# Altium schematic sheet GNSS.SchDoc: CATS Telemetry
size A4; Author: Luca Jost; Revision: 1.0; SheetNumber: 7; SheetTotal: 7; Subtitle: GNSS
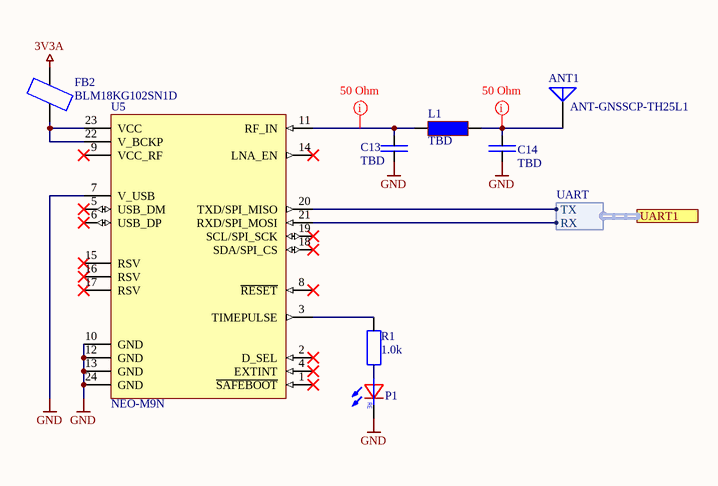
[diagram p0: GNSS.SchDoc]

## Parts
ANT1  ANT-GNSSCP-TH25L1  [THT Antenna ANT-GNSSCP-TH25L1]
C13  TBD  [SMD Keramikkondensator 0402]
C14  TBD  [SMD Keramikkondensator 0402]
FB2  BLM18KG102SN1D  [SMD Ferrite Bead 0603]
L1  TBD  [SMD Ferrite Bead 0402]
P1  LED  [SMD LED 0603]  (value not drawn)
R1  1.0k  [SMD Widerstand 0603]
U5  NEO-M9N  [SMD NEO]

## Ports
UART1 (harness UART)

## Harnesses
UART: TX, RX

## Nets
3V3A: FB2.2
GND: C13.1 C14.1 P1.K U5.7(V_USB) U5.10(GND) U5.12(GND) U5.13(GND) U5.24(GND)
NetANT1_1: ANT1.1 C14.2 L1.2
NetC13_2: C13.2 L1.1 U5.11(RF_IN)
NetFB2_1: FB2.1 U5.22(V_BCKP) U5.23(VCC)
NetP1_A: P1.A R1.1
NetR1_2: R1.2 U5.3(TIMEPULSE)
NetU5_20: U5.20(TXD/SPI_MISO) ; port UART1.TX
NetU5_21: U5.21(RXD/SPI_MOSI) ; port UART1.RX

Not connected (* = marked no-connect by the designer): U5 1(~{SAFEBOOT})* 2(D_SEL)* 4(EXTINT)* 5(USB_DM)* 6(USB_DP)* 8(~{RESET})* 9(VCC_RF)* 14(LNA_EN)* 15(RSV)* 16(RSV)* 17(RSV)* 18(SDA/SPI_CS)* 19(SCL/SPI_SCK)*

## Layout directives
rule Impedance Constraint [Min = 50.00    Max = 50.00    ]; net class RF-Line 50: NetANT1_1, NetC13_2

## Notes on the sheet
- Title
- Author:
- Subtitle
- Date:
- Rev:
- CATS
- Sheet
- of
- File:
- (in symbol LED) RE

## Library data of the parts
ANT1 = ANT-GNSSCP-TH25L1: 1.575GHz, 1.602GHz Beidou, Galileo, GLONASS, GNSS, GPS Ceramic Patch RF Antenna 1.567GHz ~ 1.609GHz 3.5dBi, 4dBi, 4dBi Pin Adhesive; ComponentLink1Description: Datasheet; ComponentLink1URL: https://linxtechnologies.com/wp/wp-content/uploads/ant-gnsscp-th25l1-ds.pdf
C13 C14 = E6 - 10pF: SMD Ceramic Capacitor E6; Unit Price: 0.01; Number: -; Supplier: -
FB2 = BLM18KG102SN1D: 1 kOhms @ 100MHz 1 Power Line Ferrite Bead 0603 (1608 Metric) 1A 200mOhm; ComponentLink1Description: Datasheet; ComponentLink1URL: https://www.murata.com/en-us/products/productdata/8796738650142/ENFA0003.pdf; Digikey: 490-17349-1-ND
L1 = Inductor Pi-Matching: Pi-Matchng Inductor
P1 = LED: Color LED
R1 = E24 - 1.0k: SMD Chip Resistor E24; Unit Price: 0.01; Number: -; Supplier: -
U5 = NEO-M9N: u-blox M9 standard precision module; ComponentLink1Description: Datasheet; ComponentLink1URL: https://www.u-blox.com/sites/default/files/NEO-M9N_Integrationmanual_%28UBX-19014286%29.pdf; Digikey: 672-NEO-M9N-00BTR-ND